# EAGLE schematic FluxamasynthPhoton (EAGLE 6.2)
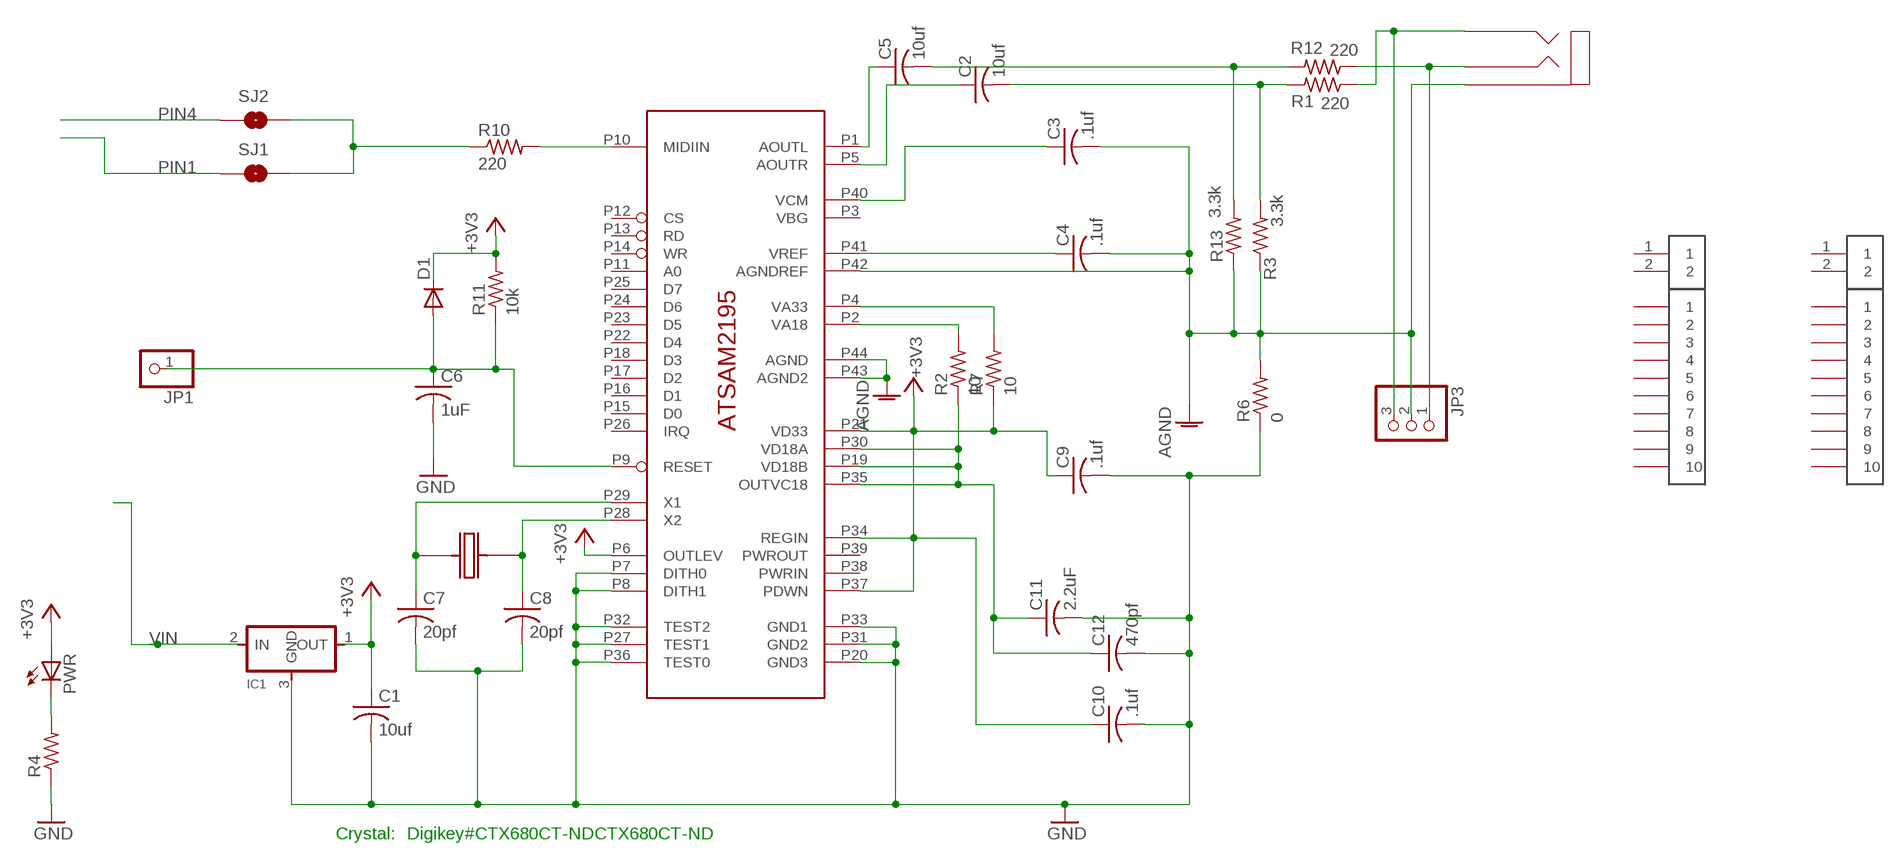
[diagram p0: schematic, sheet 1]

## Parts
C1  10uf  C-USC0603  [C0603]
C2  10uf  C-USC0603  [C0603]
C3  .1uf  C-USC0603  [C0603]
C4  .1uf  C-USC0603  [C0603]
C5  10uf  C-USC0603  [C0603]
C6  1uF  C-USC0603  [C0603]
C7  20pf  C-USC0603K  [C0603K]
C8  20pf  C-USC0603K  [C0603K]
C9  .1uf  C-USC0603  [C0603]
C10  .1uf  C-USC0603  [C0603]
C11  2.2uF  C-USC0603  [C0603]
C12  470pf  C-USC0603  [C0603]
D1  DIODESOD123  [SOD123]
IC1  REGULATORSOT23  [SOT23]
JP1  PINHD-1X1  [1X01]
JP3  PINHD-1X3CB  [1X03-CLEANBIG]
PWR  LED0603  [LED-0603]
R1  220  R-US_R0603  [R0603]
R2  10  R-US_R0603  [R0603]
R3  3.3k  R-US_R0603  [R0603]
R4  R-US_R0603  [R0603]
R6  0  R-US_R0603  [R0603]
R7  10  R-US_R0603  [R0603]
R10  220  R-US_R0603  [R0603]
R11  10k  R-US_R0603  [R0603]
R12  220  R-US_R0603  [R0603]
R13  3.3k  R-US_R0603  [R0603]
SJ1  SOLDERJUMPERNO  [SJ_2S-NO]
SJ2  SOLDERJUMPERNC2  [SJ_2S-NOTRACE]
U$1  ATSAM2195  [ATSAM2195]
U$2  CRYSTAL_7X5  [CRYSTAL_7X5]
U$3  1X10_CLEAN  [1X10_CLEAN]
U$4  STEREO_AUDIO_JACK_SMT  [STEREO_AUDIO_JACK_SMT]
U$5  1X10_CLEAN  [1X10_CLEAN]
U$6  1X2_CLEAN  [1X2_CLEAN]
U$7  1X2_CLEAN  [1X2_CLEAN]

## Nets
+3V3: C1.1 C9.1 C10.1 D1.CATHODE(C) IC1.1(OUT) PWR.A R7.1 R11.2 U$1.P6(OUTLEV) U$1.P21(VD33) U$1.P34(REGIN) U$1.P37(PDWN)
AGND: C3.2 C4.2 JP3.2 R3.1 R6.2 R13.1 U$1.P42(AGNDREF) U$1.P43(AGND2) U$1.P44(AGND) U$4.P$1(SHIELD)
CA11: C2.1 U$1.P5(AOUTR)
GND: C1.2 C6.2 C7.2 C8.2 C9.2 C10.2 C11.2 C12.2 IC1.3(GND) R4.1 R6.1 U$1.P7(DITH0) U$1.P8(DITH1) U$1.P20(GND3) U$1.P27(TEST1) U$1.P31(GND2) U$1.P32(TEST2) U$1.P33(GND1) U$1.P36(TEST0)
N$1: R10.1 SJ1.2 SJ2.2
N$2: R10.2 U$1.P10(MIDIIN)
N$3: C8.1 U$1.P28(X2) U$2.P$3
N$5: C7.1 U$1.P29(X1) U$2.P$1
N$6: C11.1 C12.1 R2.1 U$1.P19(VD18B) U$1.P30(VD18A) U$1.P35(OUTVC18)
N$7: R2.2 U$1.P2(VA18)
N$8: C5.1 U$1.P1(AOUTL)
N$9: PWR.C R4.2
N$10: C5.2 R12.2 R13.2
N$11: C2.2 R1.2 R3.2
N$12: C3.1 U$1.P40(VCM)
N$13: R7.2 U$1.P4(VA33)
N$14: C6.1 D1.ANODE(A) JP1.1 R11.1 U$1.P9(RESET)
N$20: C4.1 U$1.P41(VREF)
N$21: JP3.3 R1.1 U$4.P$2(TIP)
N$24: JP3.1 R12.1 U$4.P$3(RING)
PIN1: SJ1.1
PIN4: SJ2.1
VIN: IC1.2(IN)
Unconnected: U$1.P3(VBG) U$1.P11(A0) U$1.P12(CS) U$1.P13(RD) U$1.P14(WR) U$1.P15(D0) U$1.P16(D1) U$1.P17(D2) U$1.P18(D3) U$1.P22(D4) U$1.P23(D5) U$1.P24(D6) U$1.P25(D7) U$1.P26(IRQ) U$1.P38(PWRIN) U$1.P39(PWROUT) U$3.P$1 U$3.P$2 U$3.P$3 U$3.P$4 U$3.P$5 U$3.P$6 U$3.P$7 U$3.P$8 U$3.P$9 U$3.P$10 U$5.P$1 U$5.P$2 U$5.P$3 U$5.P$4 U$5.P$5 U$5.P$6 U$5.P$7 U$5.P$8 U$5.P$9 U$5.P$10 U$6.1 U$6.2 U$7.1 U$7.2

## Notes on the sheet
- Crystal: | Digikey#CTX680CT-NDCTX680CT-ND

## Library data of the parts
C1-C12 = ModernDevice:C-US: CAPACITOR, American symbol
D1 = ng:DIODE: DIODE high speed (Philips)
IC1 = ng:REGULATOR
JP1 = adafruit:PINHD-1X1: Pin header 1x1 for 0.1" spacing With round pins
JP3 = adafruit:PINHD-1X3: PIN HEADER
PWR = ModernDevice:LED: LEDs Standard schematic elements and footprints for 5mm, 3mm, 1206, and 0603 sized LEDs. 5mm - Spark Fun Electronics SKU : COM-00529 (and others)
R1-R4 R6 R7 R10-R13 = ModernDevice:R-US_: RESISTOR, American symbol
SJ1 SJ2 = ModernDevice:SOLDERJUMPER: Solder Jumper Standard SMD solder jumper. Used to automate production. Two varients : Normally Open and Normally Closed are the same, but have different paste layers. NC will have a large amount of paste and should jumper during reflow.
U$1 = ModernDevice:ATSAM2195
U$2 = ModernDevice:CRYSTAL_7X5
U$3 U$5 = ModernDevice:1X10_CLEAN
U$4 = ModernDevice:STEREO_AUDIO_JACK_SMT: Digikey CP-2523SJCT-ND
U$6 U$7 = ModernDevice:1X2_CLEAN